# Altium schematic sheet newMainBoard.SchDoc
size D; SheetNumber: 3; SheetTotal: 3
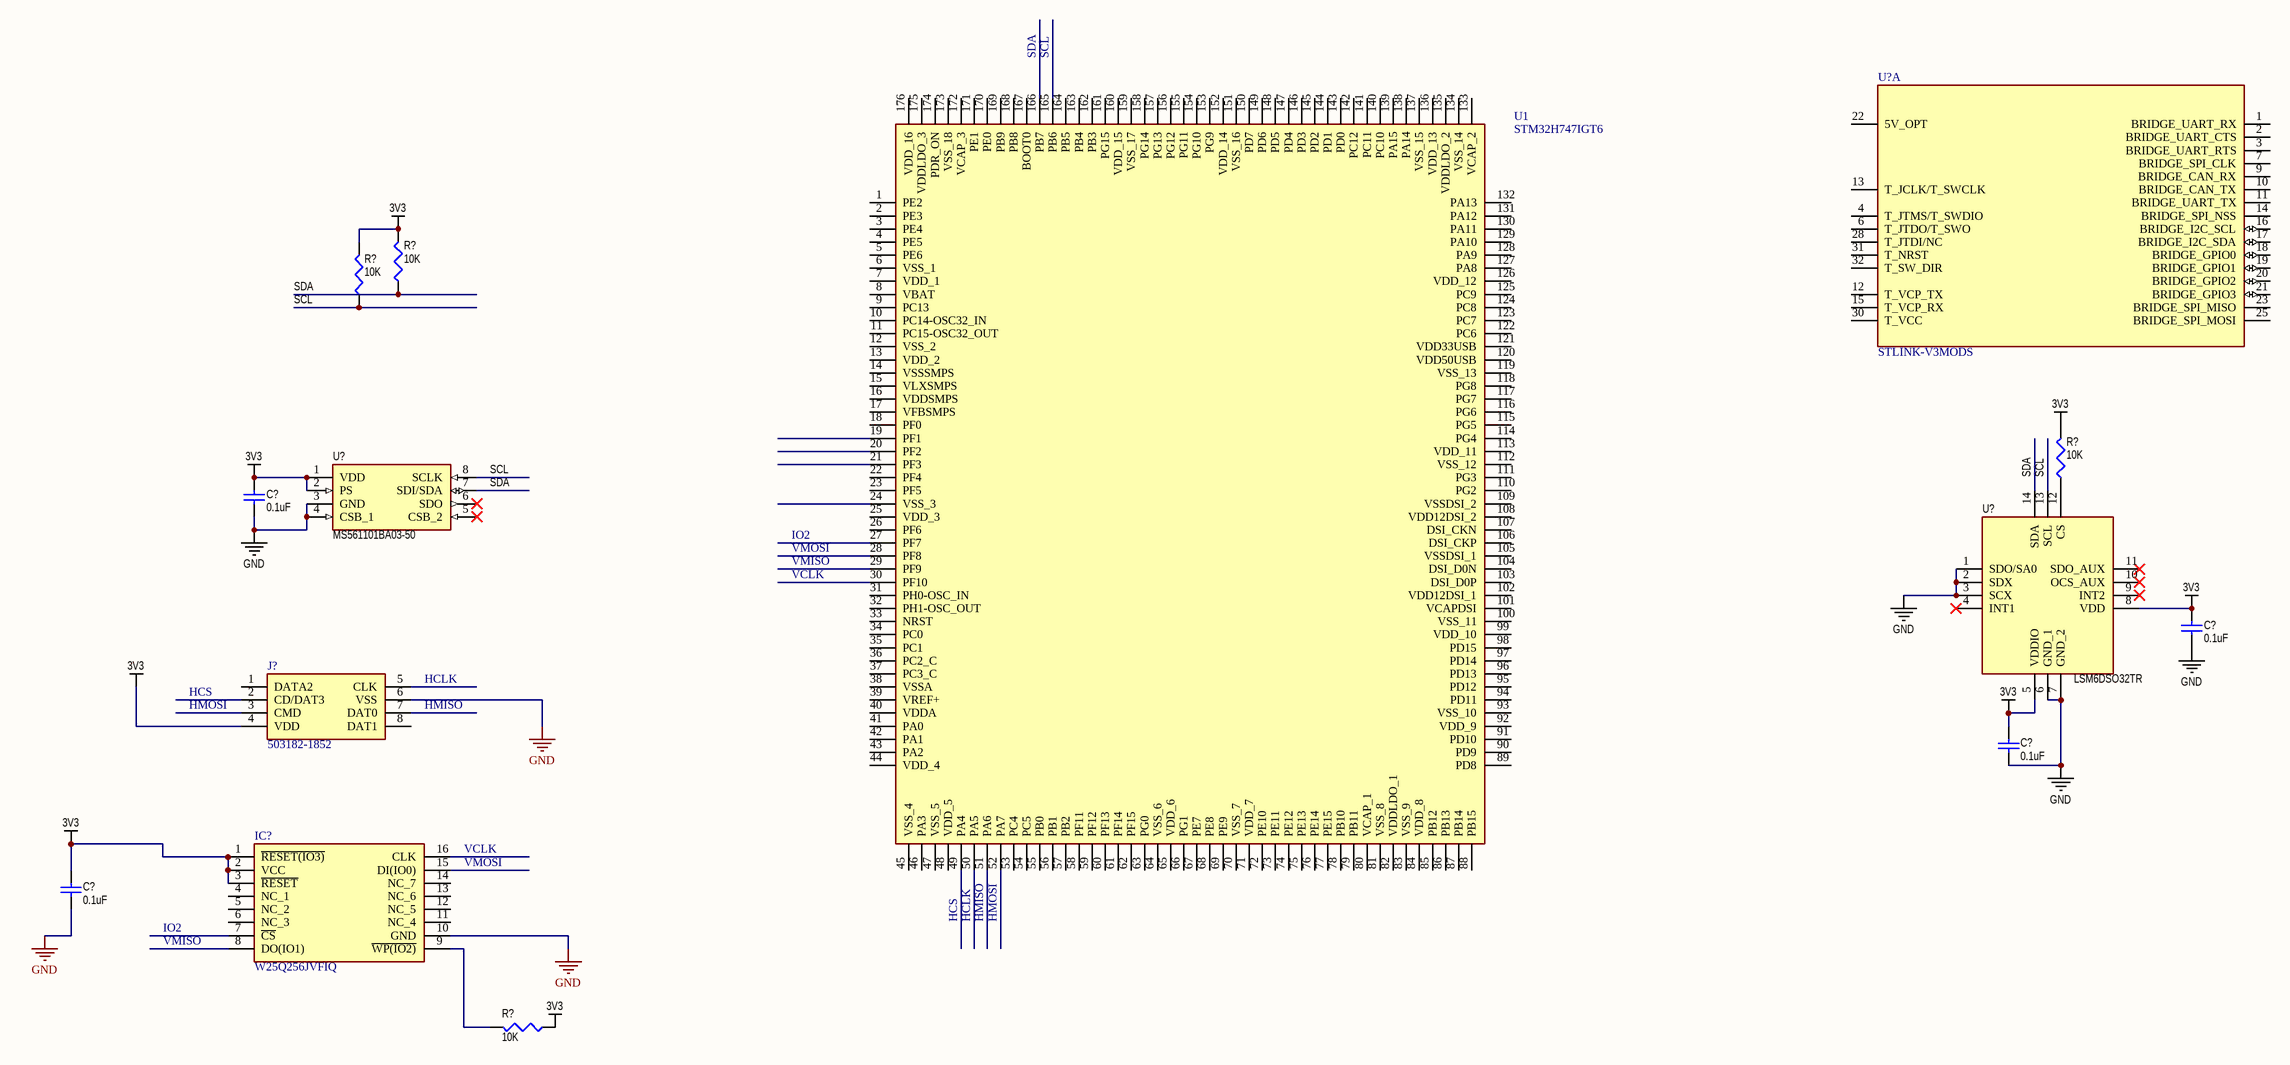
[diagram p0: newMainBoard.SchDoc]

## Parts
(Parts that share a designator on the sheet are numbered #1, #2 ... from top to bottom, then left to right.)
C?#1  0.1uF  [1608[0603]]
C?#2  0.1uF  [1608[0603]]
C?#3  0.1uF  [1608[0603]]
C?#4  0.1uF  [1608[0603]]
IC?  W25Q256JVFIQ  [SOIC127P1032X264-16N]
J?  503182-1852  [5031821852]
R?#1  10K  [J1-0603]
R?#2  10K  [J1-0603]
R?#3  10K  [J1-0603]
R?#4  10K  [J1-0603]
U1  STM32H747IGT6  [QFP50P2600X2600X160-176N]
U?#1  STLINK-V3MODS  [MODULE_STLINK-V3MODS]  (part A of 2)
U?#2  MS561101BA03-50  [MS561101BA03-50]
U?#3  LSM6DSO32TR  [LGA-14(2.5X3X0.86)]

## Nets
3V3: C?#1.2 C?#2.2 C?#3.2 C?#4.2 IC?.1(~{RESET(IO3)}) IC?.2(VCC) IC?.3(~{RESET}) J?.4(VDD) R?#1.2 R?#2.2 R?#3.2 R?#4.1 U?#2.1(VDD) U?#2.2(PS) U?#3.5(VDDIO) U?#3.8(VDD)
GND: C?#1.1 C?#2.1 C?#3.1 C?#4.1 IC?.10(GND) J?.6(VSS) U?#2.3(GND) U?#2.4(CSB_1) U?#3.1(SDO/SA0) U?#3.2(SDX) U?#3.3(SCX) U?#3.6(GND_1) U?#3.7(GND_2)
SCL: R?#2.1 U?#2.8(SCLK) U?#3.13(SCL)
SDA: R?#1.1 U?#2.7(SDI/SDA) U?#3.14(SDA)
NetIC?_9: IC?.9(~{WP(IO2)}) R?#4.2
NetR?#3_1: R?#3.1 U?#3.12(CS)

Not connected (* = marked no-connect by the designer): IC? 4(NC_1) 5(NC_2) 6(NC_3) 7(~{CS}) 8(DO(IO1)) 11(NC_4) 12(NC_5) 13(NC_6) 14(NC_7) 15(DI(IO0)) 16(CLK); J? 1(DATA2) 2(CD/DAT3) 3(CMD) 5(CLK) 7(DAT0) 8(DAT1); U1 1(PE2) 2(PE3) 3(PE4) 4(PE5) 5(PE6) 6(VSS_1) 7(VDD_1) 8(VBAT) 9(PC13) 10(PC14-OSC32_IN) 11(PC15-OSC32_OUT) 12(VSS_2) 13(VDD_2) 14(VSSSMPS) 15(VLXSMPS) 16(VDDSMPS) 17(VFBSMPS) 18(PF0) 19(PF1) 20(PF2) 21(PF3) 22(PF4) 23(PF5) 24(VSS_3) 25(VDD_3) 26(PF6) 27(PF7) 28(PF8) 29(PF9) 30(PF10) 31(PH0-OSC_IN) 32(PH1-OSC_OUT) 33(NRST) 34(PC0) 35(PC1) 36(PC2_C) 37(PC3_C) 38(VSSA) 39(VREF+) 40(VDDA) 41(PA0) 42(PA1) 43(PA2) 44(VDD_4) 45(VSS_4) 46(PA3) 47(VSS_5) 48(VDD_5) 49(PA4) 50(PA5) 51(PA6) 52(PA7) 53(PC4) 54(PC5) 55(PB0) 56(PB1) 57(PB2) 58(PF11) 59(PF12) 60(PF13) 61(PF14) 62(PF15) 63(PG0) 64(VSS_6) 65(VDD_6) 66(PG1) 67(PE7) 68(PE8) 69(PE9) 70(VSS_7) 71(VDD_7) 72(PE10) 73(PE11) 74(PE12) 75(PE13) 76(PE14) 77(PE15) 78(PB10) 79(PB11) 80(VCAP_1) 81(VSS_8) 82(VDDLDO_1) 83(VSS_9) 84(VDD_8) 85(PB12) 86(PB13) 87(PB14) 88(PB15) 89(PD8) 90(PD9) 91(PD10) 92(VDD_9) 93(VSS_10) 94(PD11) 95(PD12) 96(PD13) 97(PD14) 98(PD15) 99(VDD_10) 100(VSS_11) 101(VCAPDSI) 102(VDD12DSI_1) 103(DSI_D0P) 104(DSI_D0N) 105(VSSDSI_1) 106(DSI_CKP) 107(DSI_CKN) 108(VDD12DSI_2) 109(VSSDSI_2) 110(PG2) 111(PG3) 112(VSS_12) 113(VDD_11) 114(PG4) 115(PG5) 116(PG6) 117(PG7) 118(PG8) 119(VSS_13) 120(VDD50USB) 121(VDD33USB) 122(PC6) 123(PC7) 124(PC8) 125(PC9) 126(VDD_12) 127(PA8) 128(PA9) 129(PA10) 130(PA11) 131(PA12) 132(PA13) 133(VCAP_2) 134(VSS_14) 135(VDDLDO_2) 136(VDD_13) 137(VSS_15) 138(PA14) 139(PA15) 140(PC10) 141(PC11) 142(PC12) 143(PD0) 144(PD1) 145(PD2) 146(PD3) 147(PD4) 148(PD5) 149(PD6) 150(PD7) 151(VSS_16) 152(VDD_14) 153(PG9) 154(PG10) 155(PG11) 156(PG12) 157(PG13) 158(PG14) 159(VSS_17) 160(VDD_15) 161(PG15) 162(PB3) 163(PB4) 164(PB5) 165(PB6) 166(PB7) 167(BOOT0) 168(PB8) 169(PB9) 170(PE0) 171(PE1) 172(VCAP_3) 173(VSS_18) 174(PDR_ON) 175(VDDLDO_3) 176(VDD_16); U?#1 1(BRIDGE_UART_RX) 2(BRIDGE_UART_CTS) 3(BRIDGE_UART_RTS) 4(T_JTMS/T_SWDIO) 6(T_JTDO/T_SWO) 7(BRIDGE_SPI_CLK) 9(BRIDGE_CAN_RX) 10(BRIDGE_CAN_TX) 11(BRIDGE_UART_TX) 12(T_VCP_TX) 13(T_JCLK/T_SWCLK) 14(BRIDGE_SPI_NSS) 15(T_VCP_RX) 16(BRIDGE_I2C_SCL) 17(BRIDGE_I2C_SDA) 18(BRIDGE_GPIO0) 19(BRIDGE_GPIO1) 20(BRIDGE_GPIO2) 21(BRIDGE_GPIO3) 22(5V_OPT) 23(BRIDGE_SPI_MISO) 25(BRIDGE_SPI_MOSI) 28(T_JTDI/NC) 30(T_VCC) 31(T_NRST) 32(T_SW_DIR); U?#2 5(CSB_2)* 6(SDO)*; U?#3 4(INT1)* 9(INT2)* 10(OCS_AUX)* 11(SDO_AUX)*

## Notes on the sheet
- SDA
- SCL
- VMOSI
- VMISO
- IO2
- VCLK
- HCS
- (near J?) HCLK
- (near J?) HMOSI
- (near J?) HMISO
- (near IC?) VCLK
- (near IC?) VMOSI
- HCLK
- (near U1) HMISO
- (near U1) HMOSI

## Library data of the parts
C?#1-C?#4 = Cap: Capacitor; Published: 8-Jun-2000; LatestRevisionDate: 17-Jul-2002; LatestRevisionNote: Re-released for DXP Platform.; PackageReference: RAD-0.3; Publisher: Altium Limited; PackageDescription: Radial Cap, Thru-Hole; 2 Leads; 0.3 in Pin Spacing; Value: 0.1uF
IC? = W25Q256JVFIQ: Integrated Circuit; Manufacturer_Name: Winbond; Datasheet Link: https://www.winbond.com/hq/search-resource-file.jsp?partNo=W25Q256JVFIQ&type=datasheet; Height: 2.64mm; Manufacturer_Part_Number: W25Q256JVFIQ; Mouser Part Number: 454-W25Q256JVFIQ; Mouser Price/Stock: https://www.mouser.co.uk/ProductDetail/Winbond/W25Q256JVFIQ?qs=qSfuJ%252Bfl%2Fd66Mf%2FmOCw4Wg%3D%3D; Arrow Part Number: W25Q256JVFIQ; Arrow Price/Stock: https://www.arrow.com/en/products/w25q256jvfiq/winbond-electronics?region=nac
J? = 503182-1852: Connector; Manufacturer_Name: Molex; Datasheet Link: https://www.molex.com/pdm_docs/sd/5031821852_sd.pdf; Manufacturer_Part_Number: 503182-1852; Mouser Part Number: 538-503182-1852; Mouser Price/Stock: https://www.mouser.co.uk/ProductDetail/Molex/503182-1852?qs=s7UCm7gO1bZmpyAhCKZ26g%3D%3D
R?#1-R?#4 = Res3: Resistor; Value: 1K; Published: 8-Jun-2000; LatestRevisionDate: 29-May-2009; LatestRevisionNote: IPC-7351 Footprint Added.; PackageReference: J1-0603; Publisher: Altium Limited; PackageDescription: Chip Resistor
U1 = STM32H747IGT6: ARM Microcontrollers - MCU 16/32-BITS MICROS; Manufacturer_Name: STMicroelectronics; Geometry.Height: 1.6mm; Manufacturer_Part_Number: STM32H747IGT6; Mouser Part Number: 511-STM32H747IGT6; Mouser Price/Stock: https://www.mouser.co.uk/ProductDetail/STMicroelectronics/STM32H747IGT6?qs=%252B6g0mu59x7Kw%252BsPEalqvLg%3D%3D; Arrow Part Number: STM32H747IGT6; Arrow Price/Stock: https://www.arrow.com/en/products/stm32h747igt6/stmicroelectronics?region=nac; Datasheet Link: https://www.mouser.com/datasheet/2/389/dm00602212-1799407.pdf
U?#2 = MS561101BA03-50: Integrated Circuit; Manufacturer_Name: TE Connectivity; Datasheet Link: http://www.te.com/usa-en/search.html?q=ms5611&source=header; Manufacturer_Part_Number: MS561101BA03-50; Mouser Part Number: 824-MS561101BA03-50; Mouser Price/Stock: https://www.mouser.co.uk/ProductDetail/Measurement-Specialties/MS561101BA03-50?qs=%252BgKeJhng5iV%252BnCz6Qd5iDw%3D%3D; Arrow Part Number: MS561101BA03-50; Arrow Price/Stock: https://www.arrow.com/en/products/ms561101ba03-50/te-connectivity?region=europe
U?#3 = LSM6DSOTR: Accelerometer; Manufacturer_Name: STMicroelectronics; Datasheet Link: https://www.st.com/resource/en/datasheet/lsm6dso.pdf; Manufacturer_Part_Number: LSM6DSOTR; Mouser Part Number: 511-LSM6DSOTR; Mouser Price/Stock: https://www.mouser.co.uk/ProductDetail/STMicroelectronics/LSM6DSOTR?qs=lc2O%252BfHJPVbD197C5c7oNw%3D%3D; Arrow Part Number: LSM6DSOTR; Arrow Price/Stock: https://www.arrow.com/en/products/lsm6dsotr/stmicroelectronics
U?#1 = STLINK-V3MODS: Package: None; Price: None; Availability: Unavailable; MP: STLINK-V3MODS; Value: *